# Altium schematic sheet Sensors.SchDoc
size A4
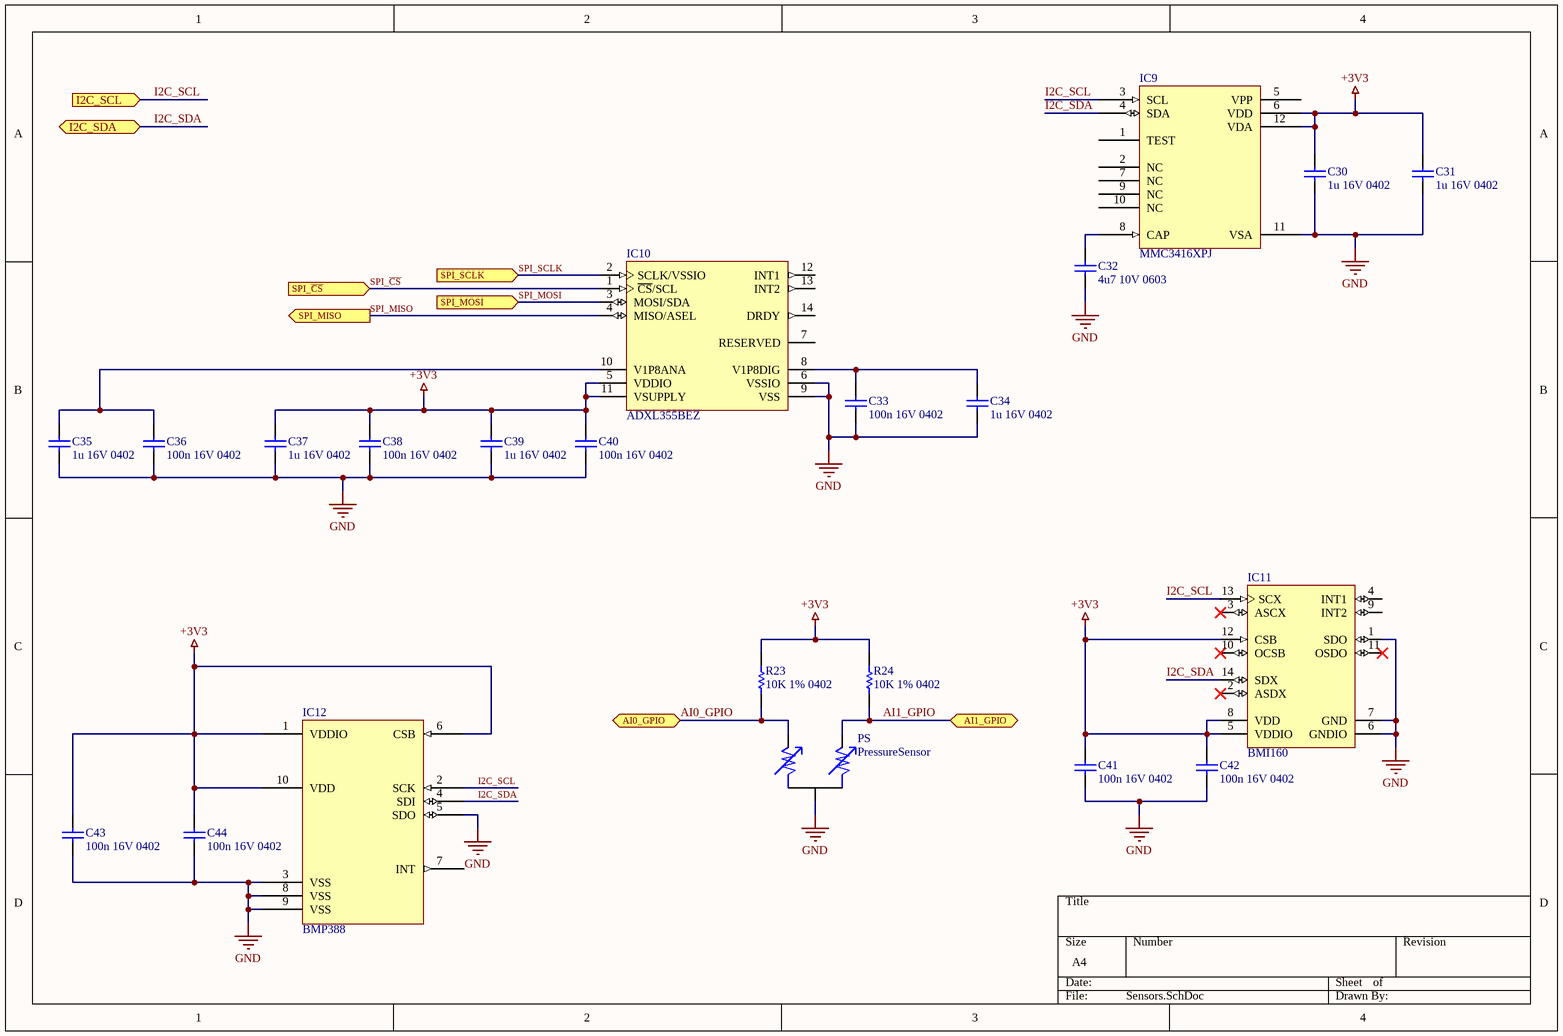
[diagram p0: Sensors.SchDoc]

## Parts
C30  1u 16V 0402  [CAPC0402(1005)60_L]
C31  1u 16V 0402  [CAPC0402(1005)60_L]
C32  4u7 10V 0603  [CAPC0603(1608)100_L]
C33  100n 16V 0402  [CAPC0402(1005)60_L]
C34  1u 16V 0402  [CAPC0402(1005)60_L]
C35  1u 16V 0402  [CAPC0402(1005)60_L]
C36  100n 16V 0402  [CAPC0402(1005)60_L]
C37  1u 16V 0402  [CAPC0402(1005)60_L]
C38  100n 16V 0402  [CAPC0402(1005)60_L]
C39  1u 16V 0402  [CAPC0402(1005)60_L]
C40  100n 16V 0402  [CAPC0402(1005)60_L]
C41  100n 16V 0402  [CAPC0402(1005)60_L]
C42  100n 16V 0402  [CAPC0402(1005)60_L]
C43  100n 16V 0402  [CAPC0402(1005)60_L]
C44  100n 16V 0402  [CAPC0402(1005)60_L]
IC9  MMC3416XPJ  [BGA12C40P4X4_160X160X72]
IC10  ADXL355BEZ  [ADI-ADXL355-LCC-14_V]
IC11  BMI160  [BOSC-BMI160_V]
IC12  BMP388  [BMP388]
PS  PressureSensor  [PressureSensor]
R23  10K 1% 0402  [RESC0402(1005)_L]
R24  10K 1% 0402  [RESC0402(1005)_L]

## Ports
AI0_GPIO (bidir), AI1_GPIO (bidir), I2C_SCL (in), I2C_SDA (bidir), SPI_MISO (out), SPI_MOSI (in), SPI_SCLK (in), SPI_~{CS} (in)

## Nets
+3V3: C30.1 C31.1 C37.1 C38.2 C39.1 C40.2 C41.2 C42.2 C43.2 C44.2 IC9.6(VDD) IC9.12(VDA) IC10.5(VDDIO) IC10.11(VSUPPLY) IC11.5(VDDIO) IC11.8(VDD) IC11.12(CSB) IC12.1(VDDIO) IC12.6(CSB) IC12.10(VDD) R23.2 R24.2
GND: C30.2 C31.2 C32.1 C33.1 C34.2 C35.2 C36.1 C37.2 C38.1 C39.2 C40.1 C41.1 C42.1 C43.1 C44.1 IC9.11(VSA) IC10.6(VSSIO) IC10.9(VSS) IC11.1(SDO) IC11.6(GNDIO) IC11.7(GND) IC12.3(VSS) IC12.5(SDO) IC12.8(VSS) IC12.9(VSS) PS.1
AI0_GPIO: PS.3 R23.1 ; port AI0_GPIO
AI1_GPIO: PS.2 R24.1 ; port AI1_GPIO
I2C_SCL: IC9.3(SCL) IC11.13(SCX) IC12.2(SCK) ; port I2C_SCL
I2C_SDA: IC9.4(SDA) IC11.14(SDX) IC12.4(SDI) ; port I2C_SDA
SPI_~{CS}: IC10.1(~{CS}/SCL) ; port SPI_~{CS}
SPI_MISO: IC10.4(MISO/ASEL) ; port SPI_MISO
SPI_MOSI: IC10.3(MOSI/SDA) ; port SPI_MOSI
SPI_SCLK: IC10.2(SCLK/VSSIO) ; port SPI_SCLK
NetC32_2: C32.2 IC9.8(CAP)
NetC33_2: C33.2 C34.1 IC10.8(V1P8DIG)
NetC35_1: C35.1 C36.2 IC10.10(V1P8ANA)

Not connected (* = marked no-connect by the designer): IC9 1(TEST) 2(NC) 5(VPP) 7(NC) 9(NC) 10(NC); IC10 7(RESERVED) 12(INT1) 13(INT2) 14(DRDY); IC11 2(ASDX)* 3(ASCX)* 4(INT1) 9(INT2) 10(OCSB)* 11(OSDO)*; IC12 7(INT)

## Library data of the parts
C30 C31 C34 C35 C37 C39 = CMP-1034-02119-1: CAP 1uF 16V ±10% 0402 (1005 Metric) Thickness 0.6mm SMD; Case-EIA: 0402; Tolerance: Â±10%; Case-Metric: 1005; Technology: SMT; Rated Voltage: 16 V; Max Thickness: 0.6 mm; Value: 1uF
C32 = CMP-1035-02787-1: CAP 4.7uF 10V ±20% 0603 (1608 Metric) Thickness 1mm SMD; Case-EIA: 0603; Case-Metric: 1608; Tolerance: Â±20%; Value: 4.7uF; Max Thickness: 1 mm; Technology: SMT; Rated Voltage: 10 V
C33 C36 C38 C40-C44 = CMP-1034-02069-1: CAP 100nF 16V ±10% 0402 (1005 Metric) Thickness 0.6mm SMD; Case-EIA: 0402; Case-Metric: 1005; Tolerance: Â±10%; Value: 100nF; Max Thickness: 0.6 mm; Rated Voltage: 16 V; Technology: SMT
IC10 = CMP-2000-07574-1: Low Noise, Low Drift, Low Power, 3-Axis MEMS Accelerometer, 2.25 to 3.6 V, -40 to 125 degC, 14-Pin LCC (E-14-1), RoHS, Tray; Manufacturer: Analog Devices; Datasheet URL: http://www.analog.com/media/en/technical-documentation/data-sheets/ADXL354_355.pdf; Package Reference: E-14-1; Manufacturer URL: http://www.analog.com/; Datasheet Version: Rev. 0, 09/2016; Package Description: 14-Pin Leadless Chip Carrier Package, Body 6.0 x 6.0 mm, Pitch 1.27 mm; RoHSCompliant: False; Mounting Technology: SurfaceMount; Number of Pins: 14; Lead Free: ContainsLead
IC11 = CMP-2000-07537-1: Small, low Power Inertial Measurement Unit, 1.2 to 3.6 V, -40 to 85 degC, 14-Pin LGA, Halogen-Free, Tape and Reel; Manufacturer: Bosch; Datasheet URL: https://ae-bst.resource.bosch.com/media/_tech/media/datasheets/BST-BMI160-DS000-07.pdf; Package Description: 14-Pullback Quad Flat No-Lead, Body 3 x 2.5 mm, Pitch 0.5 mm; Lead Free: LeadFree; Datasheet Version: Rev. 0.8, 02/2015; Mounting Technology: SurfaceMount; Manufacturer URL: https://www.bosch.com/; Package Reference: BMI160; RoHSCompliant: false
R23 R24 = CMP-1011-00623-1: 10K 0.063W 1% 0402 (1005 Metric)  SMD; Case-Metric: 1005; Value: 10000.00 Ohm; Case-EIA: 0402; Tolerance: 1 %; Technology: SMT; Power: 0.063 W